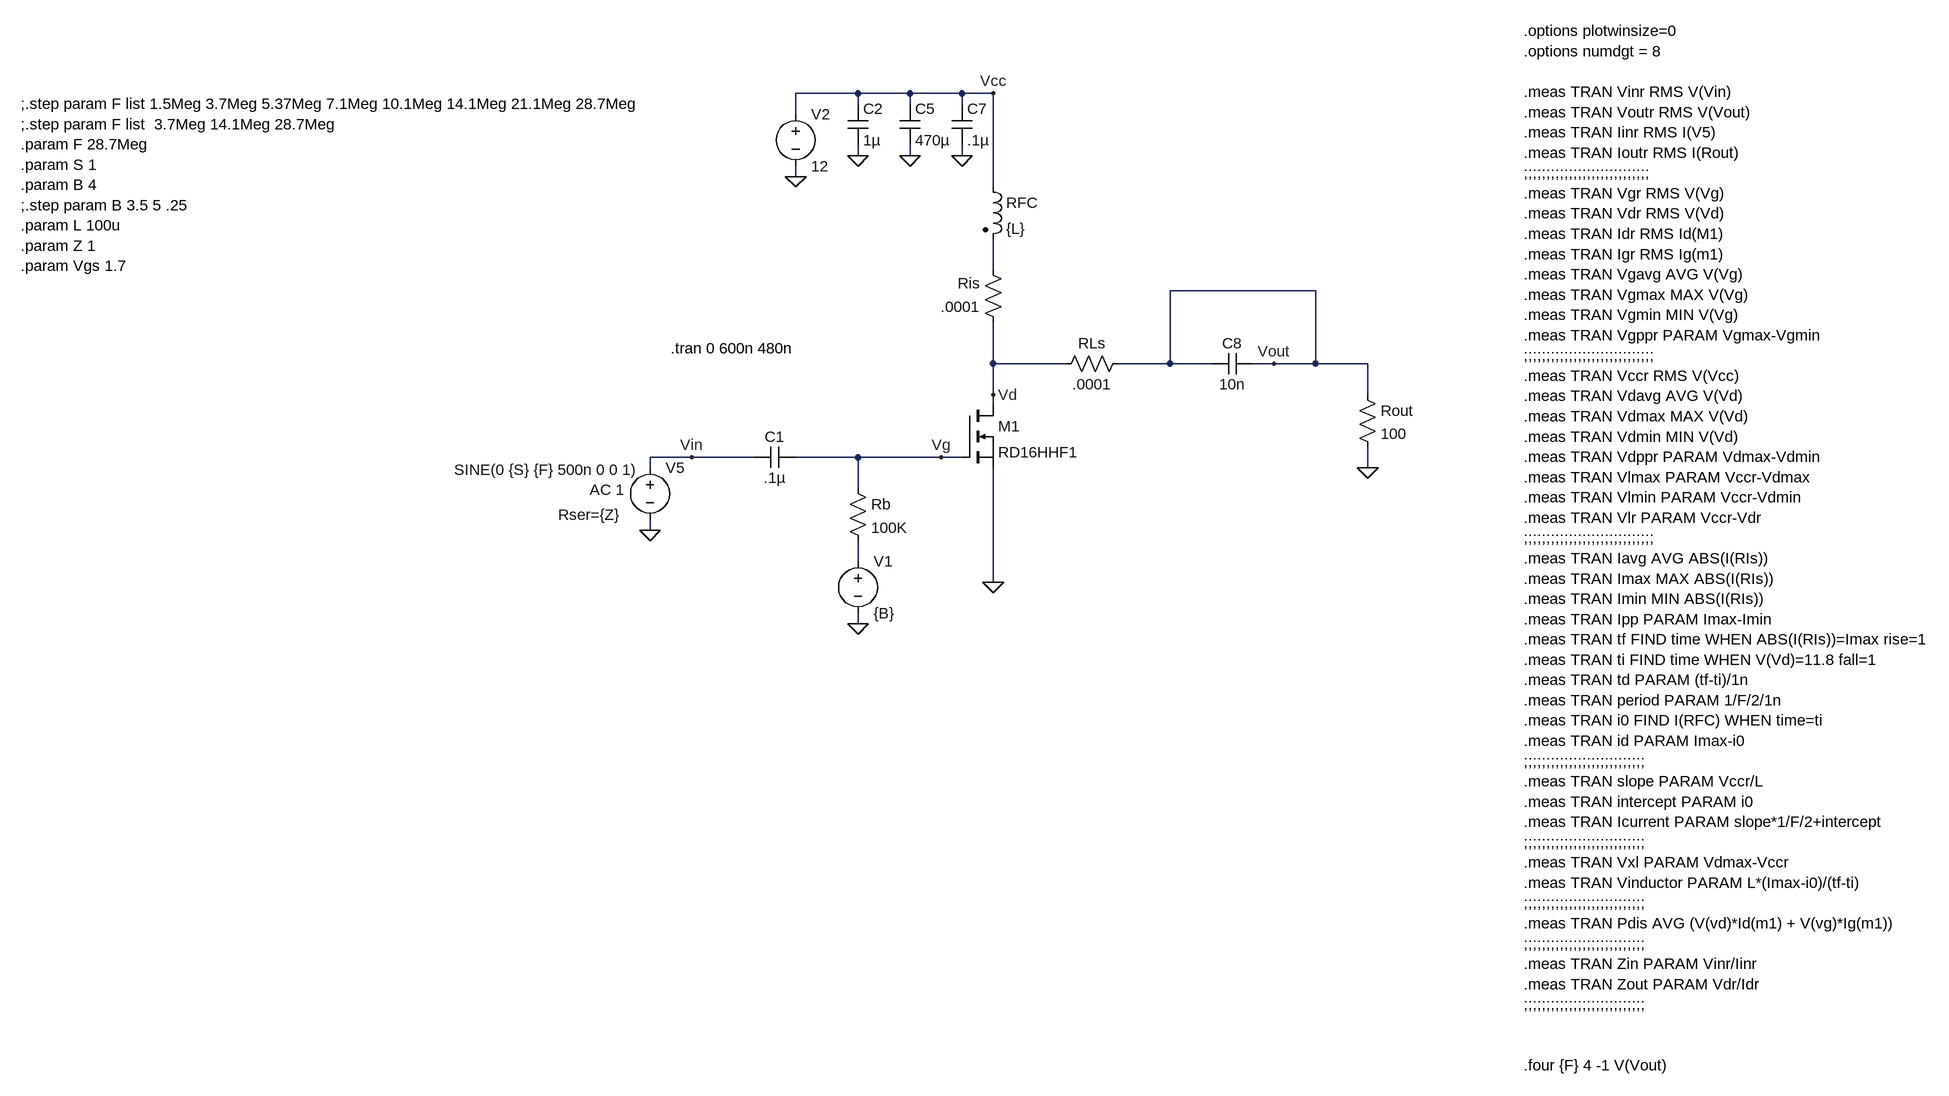
[diagram p0: schematic Inductor Kickback Testing.asc]
Inductor Kickback Testing.asc, the LTspice schematic file:
Version 4
SHEET 1 3060 1616
WIRE 1136 -464 1040 -464
WIRE 1216 -464 1136 -464
WIRE 1296 -464 1216 -464
WIRE 1344 -464 1296 -464
WIRE 1136 -448 1136 -464
WIRE 1216 -448 1216 -464
WIRE 1296 -448 1296 -464
WIRE 1040 -432 1040 -464
WIRE 1136 -368 1136 -384
WIRE 1216 -368 1216 -384
WIRE 1296 -368 1296 -384
WIRE 1040 -336 1040 -352
WIRE 1344 -320 1344 -464
WIRE 1344 -192 1344 -240
WIRE 1840 -160 1616 -160
WIRE 1344 -48 1344 -112
WIRE 1456 -48 1344 -48
WIRE 1616 -48 1616 -160
WIRE 1616 -48 1536 -48
WIRE 1680 -48 1616 -48
WIRE 1776 -48 1744 -48
WIRE 1840 -48 1840 -160
WIRE 1840 -48 1776 -48
WIRE 1920 -48 1840 -48
WIRE 1344 0 1344 -48
WIRE 1920 0 1920 -48
WIRE 1344 16 1344 0
WIRE 880 96 816 96
WIRE 976 96 880 96
WIRE 1136 96 1040 96
WIRE 1264 96 1136 96
WIRE 1296 96 1264 96
WIRE 816 112 816 96
WIRE 1920 112 1920 80
WIRE 1136 144 1136 96
WIRE 816 208 816 192
WIRE 1136 256 1136 224
WIRE 1344 288 1344 112
WIRE 1136 352 1136 336
FLAG 1040 -336 0
FLAG 1344 288 0
FLAG 1216 -368 0
FLAG 1296 -368 0
FLAG 1136 -368 0
FLAG 1920 112 0
FLAG 1776 -48 Vout
FLAG 1264 96 Vg
FLAG 1344 0 Vd
FLAG 816 208 0
FLAG 880 96 Vin
FLAG 1344 -464 Vcc
FLAG 1136 352 0
SYMBOL voltage 1040 -448 R0
WINDOW 123 0 0 Left 2
WINDOW 39 0 0 Left 2
SYMATTR InstName V2
SYMATTR Value 12
SYMBOL cap 1200 -448 R0
SYMATTR InstName C5
SYMATTR Value 470µ
SYMBOL cap 1280 -448 R0
SYMATTR InstName C7
SYMATTR Value .1µ
SYMBOL cap 1680 -32 R270
WINDOW 0 32 32 VTop 2
WINDOW 3 0 32 VBottom 2
SYMATTR InstName C8
SYMATTR Value 10n
SYMBOL cap 1120 -448 R0
SYMATTR InstName C2
SYMATTR Value 1µ
SYMBOL res 1904 -16 R0
SYMATTR InstName Rout
SYMATTR Value 100
SYMBOL voltage 816 96 R0
WINDOW 123 -93 50 Left 2
WINDOW 39 -141 88 Left 2
WINDOW 3 -301 19 Left 2
SYMATTR Value2 AC 1
SYMATTR SpiceLine Rser={Z}
SYMATTR Value SINE(0 {S} {F} 500n 0 0 1)
SYMATTR InstName V5
SYMBOL nmos 1296 16 R0
SYMATTR InstName M1
SYMATTR Value RD16HHF1
SYMBOL ind2 1328 -336 R0
SYMATTR InstName RFC
SYMATTR Value {L}
SYMATTR Type ind
SYMBOL cap 976 112 R270
WINDOW 0 32 32 VTop 2
WINDOW 3 0 32 VBottom 2
SYMATTR InstName C1
SYMATTR Value .1µ
SYMBOL voltage 1136 240 R0
WINDOW 123 24 124 Left 2
WINDOW 39 24 152 Left 2
SYMATTR InstName V1
SYMATTR Value {B}
SYMBOL res 1120 128 R0
SYMATTR InstName Rb
SYMATTR Value 100K
SYMBOL res 1552 -64 R90
WINDOW 0 0 56 VBottom 2
WINDOW 3 32 56 VTop 2
SYMATTR InstName RLs
SYMATTR Value .0001
SYMBOL res 1360 -96 R180
WINDOW 0 36 76 Left 2
WINDOW 3 36 40 Left 2
SYMATTR InstName Ris
SYMATTR Value .0001
TEXT 848 -72 Left 2 !.tran 0 600n 480n
TEXT 2160 -560 Left 2 !.options plotwinsize=0\n.options numdgt = 8\n \n.meas TRAN Vinr RMS V(Vin)\n.meas TRAN Voutr RMS V(Vout)\n.meas TRAN Iinr RMS I(V5)\n.meas TRAN Ioutr RMS I(Rout)\n;;;;;;;;;;;;;;;;;;;;;;;;;;;;\n.meas TRAN Vgr RMS V(Vg)\n.meas TRAN Vdr RMS V(Vd)\n.meas TRAN Idr RMS Id(M1)\n.meas TRAN Igr RMS Ig(m1)\n.meas TRAN Vgavg AVG V(Vg)\n.meas TRAN Vgmax MAX V(Vg)\n.meas TRAN Vgmin MIN V(Vg)\n.meas TRAN Vgppr PARAM Vgmax-Vgmin\n;;;;;;;;;;;;;;;;;;;;;;;;;;;;;\n.meas TRAN Vccr RMS V(Vcc)\n.meas TRAN Vdavg AVG V(Vd)\n.meas TRAN Vdmax MAX V(Vd)\n.meas TRAN Vdmin MIN V(Vd)\n.meas TRAN Vdppr PARAM Vdmax-Vdmin\n.meas TRAN Vlmax PARAM Vccr-Vdmax \n.meas TRAN Vlmin PARAM Vccr-Vdmin\n.meas TRAN Vlr PARAM Vccr-Vdr \n;;;;;;;;;;;;;;;;;;;;;;;;;;;;;\n.meas TRAN Iavg AVG ABS(I(RIs))\n.meas TRAN Imax MAX ABS(I(RIs))\n.meas TRAN Imin MIN ABS(I(RIs))\n.meas TRAN Ipp PARAM Imax-Imin\n.meas TRAN tf FIND time WHEN ABS(I(RIs))=Imax rise=1\n.meas TRAN ti FIND time WHEN V(Vd)=11.8 fall=1\n.meas TRAN td PARAM (tf-ti)/1n\n.meas TRAN period PARAM 1/F/2/1n\n.meas TRAN i0 FIND I(RFC) WHEN time=ti\n.meas TRAN id PARAM Imax-i0\n;;;;;;;;;;;;;;;;;;;;;;;;;;;\n.meas TRAN slope PARAM Vccr/L\n.meas TRAN intercept PARAM i0\n.meas TRAN Icurrent PARAM slope*1/F/2+intercept\n;;;;;;;;;;;;;;;;;;;;;;;;;;;\n.meas TRAN Vxl PARAM Vdmax-Vccr\n.meas TRAN Vinductor PARAM L*(Imax-i0)/(tf-ti)\n;;;;;;;;;;;;;;;;;;;;;;;;;;;\n.meas TRAN Pdis AVG (V(vd)*Id(m1) + V(vg)*Ig(m1))\n;;;;;;;;;;;;;;;;;;;;;;;;;;;\n.meas TRAN Zin PARAM Vinr/Iinr\n.meas TRAN Zout PARAM Vdr/Idr\n;;;;;;;;;;;;;;;;;;;;;;;;;;;\n \n \n.four {F} 4 -1 V(Vout)
TEXT -152 -448 Left 2 !;.step param F list 1.5Meg 3.7Meg 5.37Meg 7.1Meg 10.1Meg 14.1Meg 21.1Meg 28.7Meg\n;.step param F list  3.7Meg 14.1Meg 28.7Meg\n.param F 28.7Meg\n.param S 1\n.param B 4\n;.step param B 3.5 5 .25\n.param L 100u\n.param Z 1\n.param Vgs 1.7

The netlist it stands for:
* Inductor Kickback Testing.asc
V2 Vcc 0 12
C5 Vcc 0 470µ
C7 Vcc 0 .1µ
C8 Vout Vout 10n
C2 Vcc 0 1µ
Rout Vout 0 100
V5 Vin 0 SINE(0 {S} {F} 500n 0 0 1) AC 1 Rser={Z}
M1 Vd Vg 0 0 RD16HHF1
L§RFC Vcc N001 {L}
C1 Vin Vg .1µ
V1 N002 0 {B}
Rb Vg N002 100K
RLs Vout Vd .0001
Ris Vd N001 .0001
.model NMOS NMOS
.model PMOS PMOS
.lib standard.mos
.tran 0 600n 480n
.options plotwinsize=0
.options numdgt = 8
.meas TRAN Vinr RMS V(Vin)
.meas TRAN Voutr RMS V(Vout)
.meas TRAN Iinr RMS I(V5)
.meas TRAN Ioutr RMS I(Rout)
;;;;;;;;;;;;;;;;;;;;;;;;;;;;
.meas TRAN Vgr RMS V(Vg)
.meas TRAN Vdr RMS V(Vd)
.meas TRAN Idr RMS Id(M1)
.meas TRAN Igr RMS Ig(m1)
.meas TRAN Vgavg AVG V(Vg)
.meas TRAN Vgmax MAX V(Vg)
.meas TRAN Vgmin MIN V(Vg)
.meas TRAN Vgppr PARAM Vgmax-Vgmin
;;;;;;;;;;;;;;;;;;;;;;;;;;;;;
.meas TRAN Vccr RMS V(Vcc)
.meas TRAN Vdavg AVG V(Vd)
.meas TRAN Vdmax MAX V(Vd)
.meas TRAN Vdmin MIN V(Vd)
.meas TRAN Vdppr PARAM Vdmax-Vdmin
.meas TRAN Vlmax PARAM Vccr-Vdmax
.meas TRAN Vlmin PARAM Vccr-Vdmin
.meas TRAN Vlr PARAM Vccr-Vdr
;;;;;;;;;;;;;;;;;;;;;;;;;;;;;
.meas TRAN Iavg AVG ABS(I(RIs))
.meas TRAN Imax MAX ABS(I(RIs))
.meas TRAN Imin MIN ABS(I(RIs))
.meas TRAN Ipp PARAM Imax-Imin
.meas TRAN tf FIND time WHEN ABS(I(RIs))=Imax rise=1
.meas TRAN ti FIND time WHEN V(Vd)=11.8 fall=1
.meas TRAN td PARAM (tf-ti)/1n
.meas TRAN period PARAM 1/F/2/1n
.meas TRAN i0 FIND I(RFC) WHEN time=ti
.meas TRAN id PARAM Imax-i0
;;;;;;;;;;;;;;;;;;;;;;;;;;;
.meas TRAN slope PARAM Vccr/L
.meas TRAN intercept PARAM i0
.meas TRAN Icurrent PARAM slope*1/F/2+intercept
;;;;;;;;;;;;;;;;;;;;;;;;;;;
.meas TRAN Vxl PARAM Vdmax-Vccr
.meas TRAN Vinductor PARAM L*(Imax-i0)/(tf-ti)
;;;;;;;;;;;;;;;;;;;;;;;;;;;
.meas TRAN Pdis AVG (V(vd)*Id(m1) + V(vg)*Ig(m1))
;;;;;;;;;;;;;;;;;;;;;;;;;;;
.meas TRAN Zin PARAM Vinr/Iinr
.meas TRAN Zout PARAM Vdr/Idr
;;;;;;;;;;;;;;;;;;;;;;;;;;;
.four {F} 4 -1 V(Vout)
;.step param F list 1.5Meg 3.7Meg 5.37Meg 7.1Meg 10.1Meg 14.1Meg 21.1Meg 28.7Meg
;.step param F list  3.7Meg 14.1Meg 28.7Meg
.param F 28.7Meg
.param S 1
.param B 4
;.step param B 3.5 5 .25
.param L 100u
.param Z 1
.param Vgs 1.7
.backanno
.end